# EAGLE design Sensor IR (EAGLE 9.2.0)
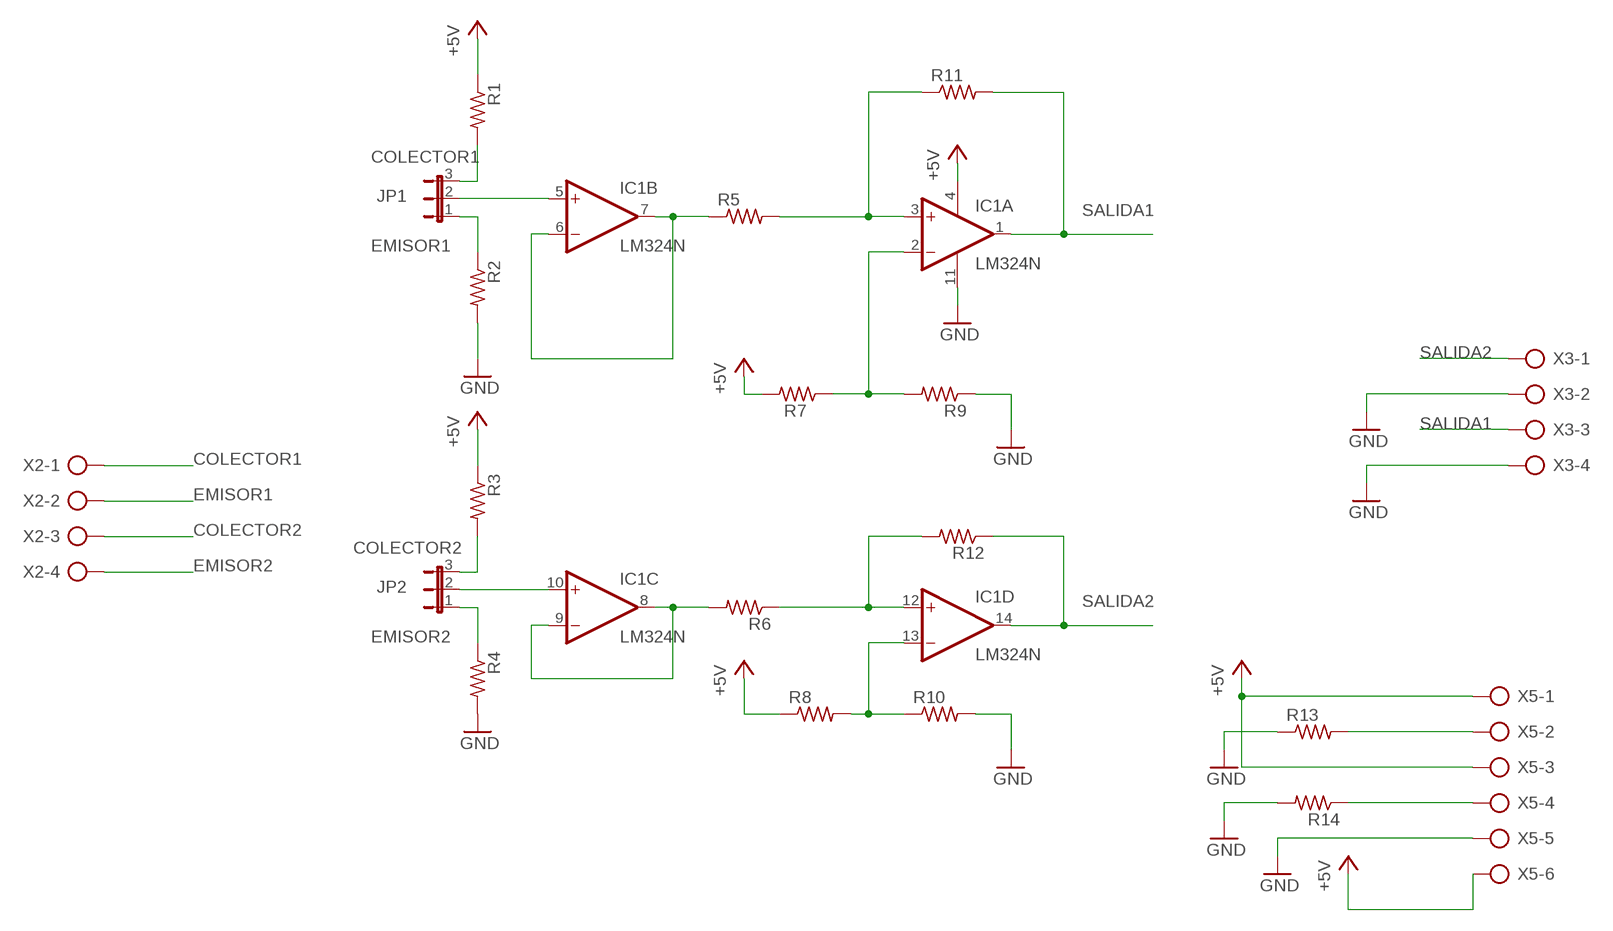
[diagram p0: schematic, sheet 1]

## Parts
IC1  LM324N  [DIL14]
JP1  JP2E  [JP2]
JP2  JP2E  [JP2]
R1  R-US_0207/10  [0207/10]
R2  R-US_0207/10  [0207/10]
R3  R-US_0207/10  [0207/10]
R4  R-US_0207/10  [0207/10]
R5  R-US_0207/10  [0207/10]
R6  R-US_0207/10  [0207/10]
R7  R-US_0207/10  [0207/10]
R8  R-US_0207/10  [0207/10]
R9  R-US_0207/10  [0207/10]
R10  R-US_0207/10  [0207/10]
R11  R-US_0207/10  [0207/10]
R12  R-US_0207/10  [0207/10]
R13  R-US_0207/10  [0207/10]
R14  R-US_0207/10  [0207/10]
X2  AK500/4-H  [AK500/4-H]
X3  AK500/4-H  [AK500/4-H]
X5  AK500/6-H  [AK500/6-H]

## Nets
+5V: IC1.4(P:V+) R1.1 R3.1 R7.2 R8.1 X5.1 X5.3 X5.6
COLECTOR1: JP1.3 R1.2 X2.1
COLECTOR2: JP2.3 R3.2 X2.3
EMISOR1: JP1.1 R2.1 X2.2
EMISOR2: JP2.1 R4.1 X2.4
GND: IC1.11(P:V-) R2.2 R4.2 R9.1 R10.2 R13.1 R14.2 X3.2 X3.4 X5.5
N$1: IC1.6(B:-IN) IC1.7(B:OUT) R5.1
N$2: IC1.8(C:OUT) IC1.9(C:-IN) R6.2
N$3: IC1.3(A:+IN) R5.2 R11.1
N$4: R14.1 X5.4
N$5: R13.2 X5.2
N$6: IC1.5(B:+IN) JP1.2
N$7: IC1.13(D:-IN) R8.2 R10.1
N$8: IC1.12(D:+IN) R6.1 R12.2
N$10: IC1.2(A:-IN) R7.1 R9.2
N$11: IC1.10(C:+IN) JP2.2
SALIDA1: IC1.1(A:OUT) R11.2 X3.3
SALIDA2: IC1.14(D:OUT) R12.1 X3.1

## Library data of the parts
IC1 = linear3:LM324: OP AMP
JP1 JP2 = jumper:JP2E: JUMPER
R1-R14 = rcl:R-US_: RESISTOR, American symbol; SPICEPREFIX: R
X2 X3 = con-ptr500:AK500/4-H: CONNECTOR Aug. 2004 / PTR Meßtechnik: Die Bezeichnung der Serie AK505 wurde geändert. Es handelt sich hierbei um AK500 in horizontaler Ausführung.; OC_FARNELL: unknown; OC_NEWARK: unknown
X5 = con-ptr500:AK500/6-H: CONNECTOR Aug. 2004 / PTR Meßtechnik: Die Bezeichnung der Serie AK505 wurde geändert. Es handelt sich hierbei um AK500 in horizontaler Ausführung.

## Board
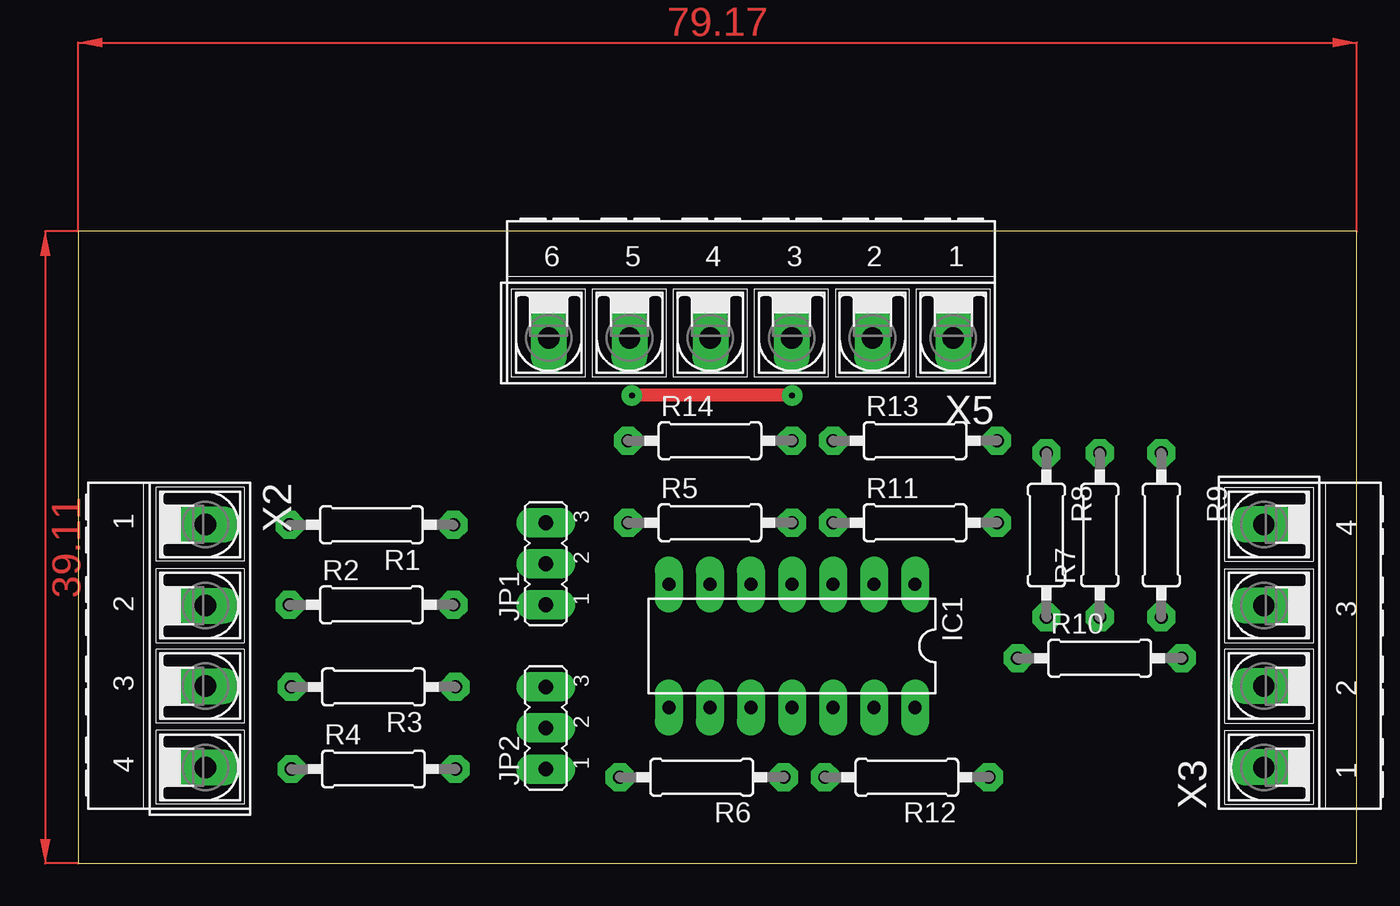
[diagram p1: board, top side]
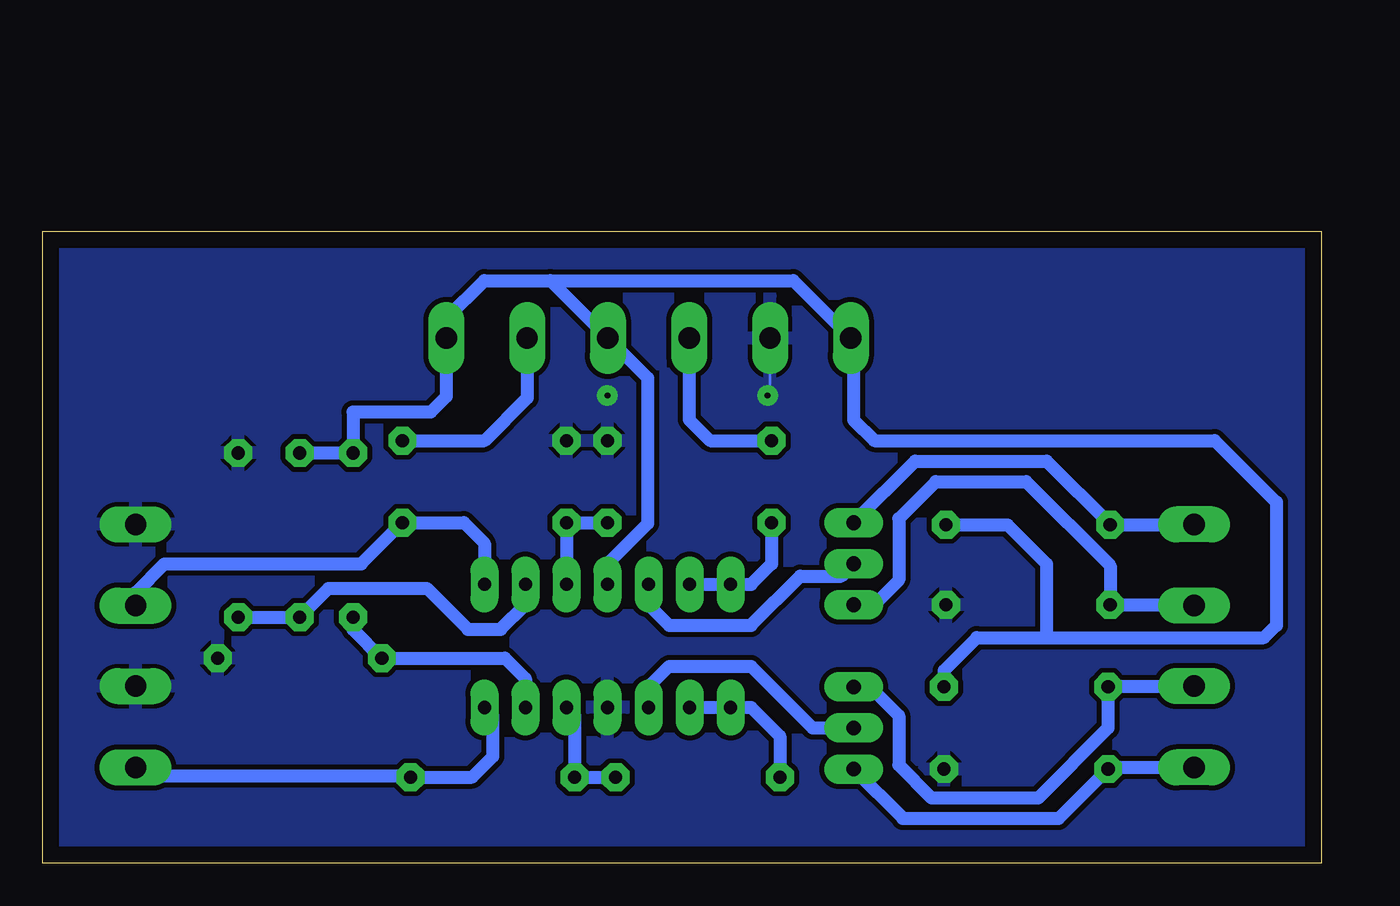
[diagram p2: board, bottom side, seen from below]

Size 79.17 x 39.11 mm. Coordinates in mm from the lower left corner, seen from the top.
Outline: 0,0 79.17,0 79.17,39.11 0,39.11 0,0
Copper layers (1*16): Top 0.035mm / dielectric 1.5mm / Bottom 0.035mm
Design rules "default *": minimum track width 6mil, minimum drill 0.35mm, track to track 12mil, track to pad 12mil, pad to pad 12mil, via to via 12mil, smd to smd 6mil, copper to edge 40mil, drill to drill 6mil, minimum pad ring 18mil, minimum via ring 18mil, stop-mask expansion 4mil, vias tented up to drill 0mil, thermal gap 10mil

### Footprints (pad centres in the part's own frame; a part is rotated, then mirrored left to right if it is on the bottom)
DIL14 = drill 0.813 long: 1 -7.62,-3.81; 2 -5.08,-3.81; 3 -2.54,-3.81; 4 0,-3.81; 5 2.54,-3.81; 6 5.08,-3.81; 7 7.62,-3.81; 8 7.62,3.81; 9 5.08,3.81; 10 2.54,3.81; 11 0,3.81; 12 -2.54,3.81; 13 -5.08,3.81; 14 -7.62,3.81
JP2 = drill 0.914 long: 1 -2.54,0; 2 0,0; 3 2.54,0
0207/10 = drill 0.813 octagon: 1 -5.08,0; 2 5.08,0
AK500/4-H = drill 1.321 long: 1 -7.518,0; 2 -2.489,0; 3 2.489,0; 4 7.518,0
AK500/6-H = drill 1.321 long: 1 -12.522,0; 2 -7.518,0; 3 -2.515,0; 4 2.515,0; 5 7.518,0; 6 12.522,0

### Placement (x,y rotation side)
IC1  44.2,13.46 180 top
JP1  28.96,18.54 90 top
JP2  28.96,8.38 90 top
R1  18.16,20.95 180 top
R2  18.16,16 0 top
R3  18.29,10.92 180 top
R4  18.29,5.84 0 top
R5  39.12,21.08 0 top
R6  38.61,5.33 180 top
R7  63.25,20.32 90 top
R8  59.94,20.32 270 top
R9  67.06,20.32 270 top
R10  63.25,12.7 0 top
R11  51.82,21.08 0 top
R12  51.31,5.33 180 top
R13  51.82,26.16 0 top
R14  39.12,26.16 0 top
X2  7.87,13.46 270 top
X3  73.41,13.46 90 top
X5  41.66,32.51 180 top

### Tracks (layer width: path | path; a pad name or v marks a point on that pad's centre or on a via)
+5V
  Bottom 0.813: R3.1 23.37,11.94 21.34,13.97 17.02,13.97 | 17.02,13.97 3.56,13.97 2.79,14.73 2.79,22.35 6.6,26.16 27.69,26.16 28.96,27.43 28.96,32.33 X5.6 32.69,36.07 47.73,36.07 | R1.1 19.43,20.95 17.02,18.54 17.02,13.97 | IC1.4 44.2,18.54 41.71,21.03 41.71,30.05 X5.3 47.73,36.07 | 47.73,36.07 51.82,36.07 54.18,33.71 X5.1 54.18,28.88 55.12,27.94 59.94,27.94 R8.1 R7.2
COLECTOR1
  Bottom 0.813: X2.1 7.9,20.95 R1.2 17.02,24.89 25.15,24.89 JP1.3
COLECTOR2
  Bottom 0.813: X2.3 13.16,10.97 R3.2 13.21,8.38 17.53,4.06 24.13,4.06 26.16,6.1 26.16,9.14 27.94,10.92 JP2.3
EMISOR1
  Bottom 0.813: X2.2 7.92,16 R2.1 13.08,18.41 18.29,23.62 23.88,23.62 26.16,21.34 26.16,17.53 27.69,16 JP1.1
EMISOR2
  Bottom 0.813: X2.4 13.11,5.94 R4.1 16.26,2.79 25.91,2.79 JP2.1
GND  (via drill 0.35)
  Top 0.813: v44.2,28.96 v34.29,28.96
  Bottom 0.152: X5.5 34.14,29.11 v34.29,28.96
  pour Bottom: -2.29,42.16 -2.29,-2.29 82.55,-2.29 82.55,42.16
N$1
  Bottom 0.813: IC1.6 IC1.7 35.31,17.27 34.04,18.54 R5.1
N$2
  Bottom 0.813: IC1.9 IC1.8 35.31,9.65 33.53,7.87 R6.2
N$3
  Bottom 0.813: R5.2 R11.1 IC1.3
N$4
  Bottom 0.813: R14.1 37.85,26.16 39.14,27.46 X5.4
N$5
  Bottom 0.813: R13.2 51.82,26.16 49.17,28.8 X5.2
N$6
  Bottom 0.813: JP1.2 29.72,17.78 32.26,17.78 35.31,14.73 40.39,14.73 41.66,16 IC1.5
N$7
  Bottom 0.813: IC1.13 49.28,11.43 50.55,12.7 R10.1 59.94,14.48 R8.2
N$8
  Bottom 0.813: R6.1 R12.2 46.23,9.14 IC1.12
N$10
  Bottom 0.813: IC1.2 49.28,16 50.8,14.48 52.83,14.48 55.37,17.02 61.47,17.02 R7.1 R9.2
N$11
  Bottom 0.813: JP2.2 31.5,8.38 35.31,12.19 40.39,12.19 41.66,10.92 IC1.10
SALIDA1
  Bottom 0.813: IC1.1 51.82,19.81 53.09,21.08 R11.2 59.44,18.54 71.63,18.54 73.41,16.76 X3.3
SALIDA2
  Bottom 0.813: IC1.14 51.31,9.14 51.31,6.6 52.58,5.33 R12.1 56.49,5.44 72.9,5.44 X3.1
(copper drawn outside any net)
  shapes: Top area x2